# Altium project Circuit.PrjPcb
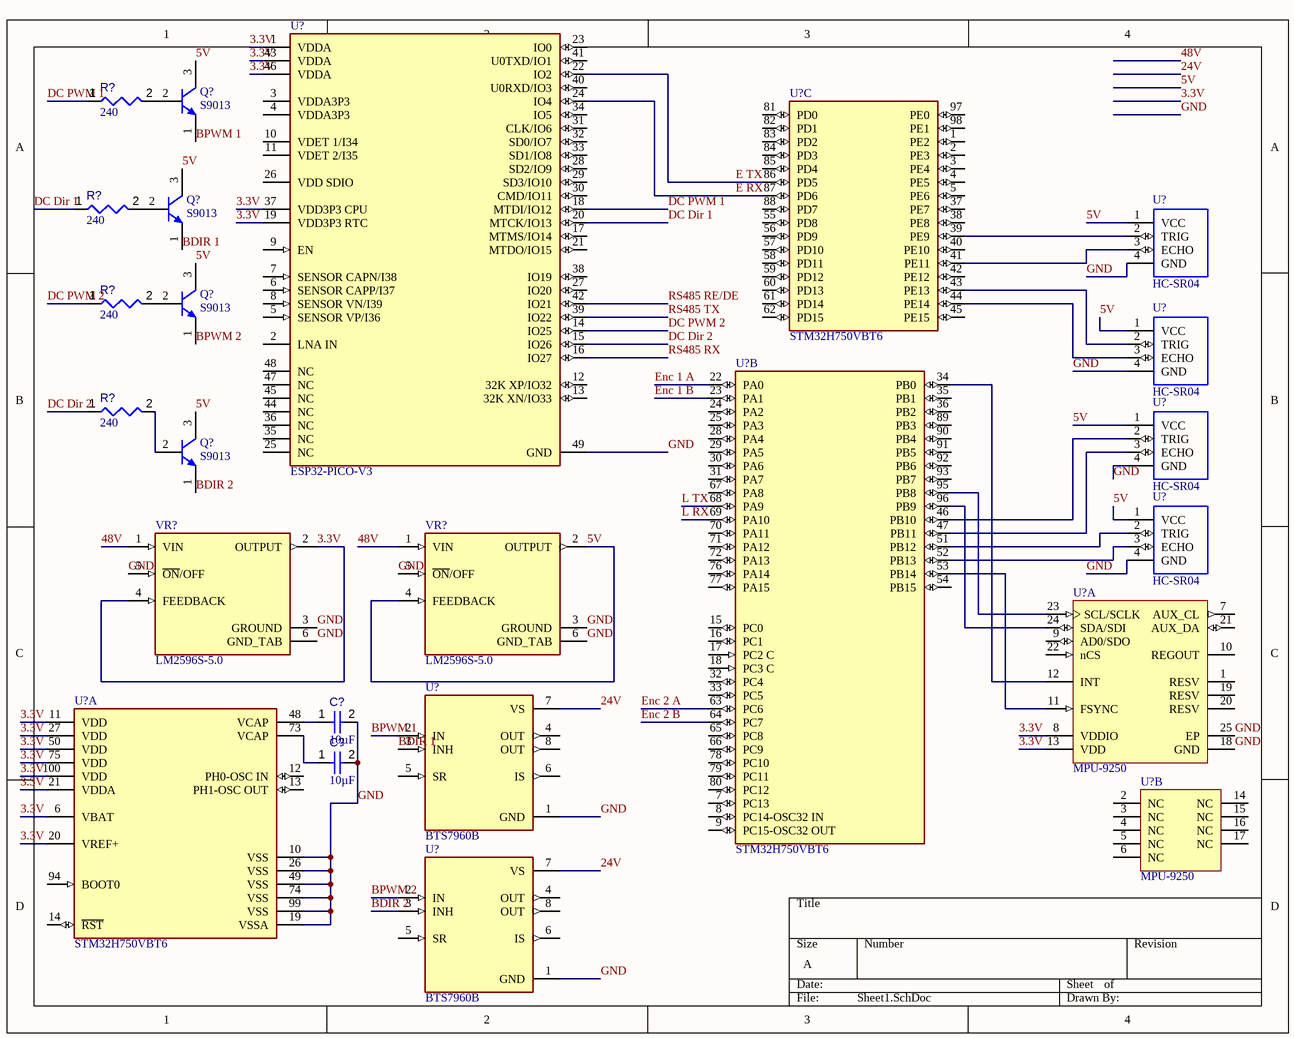
[diagram p0: Sheet1.SchDoc]
Author: Hassan; Project: Wheeled-Bi-Pedal-Robot; Schematic Name: Circuit Schematic
1 sheet, 24 parts. Net scope: global (net labels, ports and power ports of the same name join across sheets).
Board file: PCB1.PcbDoc

## Sheet Sheet1.SchDoc
size A; SheetNumber: 1; SheetTotal: 1

### Parts
(Parts that share a designator on the sheet are numbered #1, #2 ... from top to bottom, then left to right.)
C?#1  value 10µF  [CAPC0805(2012)145_L]  (hidden comment: Capacitor 10µF +/-20% 25V 0805)
C?#2  value 10µF  [CAPC0805(2012)145_L]  (hidden comment: Capacitor 10µF +/-20% 25V 0805)
Q?#1  S9013  [JSCJ-TO-92-3_V]
Q?#2  S9013  [JSCJ-TO-92-3_V]
Q?#3  S9013  [JSCJ-TO-92-3_V]
Q?#4  S9013  [JSCJ-TO-92-3_V]
R?#1  value 240  [RESC0402(1005)_L]  (hidden comment: 240R2J)
R?#2  value 240  [RESC0402(1005)_L]  (hidden comment: 240R2J)
R?#3  value 240  [RESC0402(1005)_L]  (hidden comment: 240R2J)
R?#4  value 240  [RESC0402(1005)_L]  (hidden comment: 240R2J)
U?#1  ESP32-PICO-V3  [FP-ESP32-PICO-V3-MFG]
U?#2  STM32H750VBT6  [FP-LQFP100-1L-MFG]  (part C of 3)
U?#3  HC-SR04  [XCVR_HC-SR04]
U?#4  HC-SR04  [XCVR_HC-SR04]
U?#5  STM32H750VBT6  [FP-LQFP100-1L-MFG]  (part B of 3)
U?#6  HC-SR04  [XCVR_HC-SR04]
U?#7  HC-SR04  [XCVR_HC-SR04]
U?#8  MPU-9250  [INSE-QFN-24-1700X1540TP_M]  (part A of 2)
U?#9  STM32H750VBT6  [FP-LQFP100-1L-MFG]  (part A of 3)
U?#10  BTS7960B  [DPAK127P1490X440-8N]
U?#11  MPU-9250  [INSE-QFN-24-1700X1540TP_M]  (part B of 2)
U?#12  BTS7960B  [DPAK127P1490X440-8N]
VR?#1  LM2596S-5.0  [TO170P1524X483-6N]
VR?#2  LM2596S-5.0  [TO170P1524X483-6N]

### Nets
3.3V: U?#1.1(VDDA) U?#1.19(VDD3P3_RTC) U?#1.37(VDD3P3_CPU) U?#1.43(VDDA) U?#1.46(VDDA) U?#8.8(VDDIO) U?#8.13(VDD) U?#9.6(VBAT) U?#9.11(VDD) U?#9.20(VREF+) U?#9.21(VDDA) U?#9.27(VDD) U?#9.50(VDD) U?#9.75(VDD) U?#9.100(VDD) VR?#1.2(OUTPUT) VR?#1.4(FEEDBACK)
5V: Q?#1.3(C) Q?#2.3(C) Q?#3.3(C) Q?#4.3(C) U?#3.1(VCC) U?#4.1(VCC) U?#6.1(VCC) U?#7.1(VCC) VR?#2.2(OUTPUT) VR?#2.4(FEEDBACK)
24V: U?#10.7(VS) U?#12.7(VS)
48V: VR?#1.1(VIN) VR?#2.1(VIN)
BDIR 1: Q?#2.1(E) U?#10.3(INH)
BDIR 2: Q?#4.1(E) U?#12.3(INH)
BPWM 1: Q?#1.1(E) U?#10.2(IN)
BPWM 2: Q?#3.1(E) U?#12.2(IN)
DC Dir 1: R?#2.1 U?#1.20(MTCK/IO13)
DC Dir 2: R?#4.1 U?#1.15(IO26)
DC PWM 1: R?#1.1 U?#1.18(MTDI/IO12)
DC PWM 2: R?#3.1 U?#1.14(IO25)
E RX: U?#1.24(IO4) U?#2.87(PD6)
E TX: U?#1.22(IO2) U?#2.86(PD5)
Enc 1 A: U?#5.22(PA0)
Enc 1 B: U?#5.23(PA1)
Enc 2 A: U?#5.63(PC6)
Enc 2 B: U?#5.64(PC7)
GND: C?#1.2 C?#2.2 U?#1.49(GND) U?#3.4(GND) U?#4.4(GND) U?#6.4(GND) U?#7.4(GND) U?#8.18(GND) U?#8.25(EP) U?#9.10(VSS) U?#9.19(VSSA) U?#9.26(VSS) U?#9.49(VSS) U?#9.74(VSS) U?#9.99(VSS) U?#10.1(GND) U?#12.1(GND) VR?#1.3(GROUND) VR?#1.5(~{ON}/OFF) VR?#1.6(GND_TAB) VR?#2.3(GROUND) VR?#2.5(~{ON}/OFF) VR?#2.6(GND_TAB)
L RX: U?#5.69(PA10)
L TX: U?#5.68(PA9)
RS485 RE/DE: U?#1.42(IO21)
RS485 RX: U?#1.16(IO27)
RS485 TX: U?#1.39(IO22)
NetC?#1_1: C?#1.1 U?#9.48(VCAP)
NetC?#2_1: C?#2.1 U?#9.73(VCAP)
NetQ?#1_2: Q?#1.2(B) R?#1.2
NetQ?#2_2: Q?#2.2(B) R?#2.2
NetQ?#3_2: Q?#3.2(B) R?#3.2
NetQ?#4_2: Q?#4.2(B) R?#4.2
NetU?#2_39: U?#2.39(PE9) U?#3.2(TRIG)
NetU?#2_41: U?#2.41(PE11) U?#3.3(ECHO)
NetU?#2_43: U?#2.43(PE13) U?#4.2(TRIG)
NetU?#2_44: U?#2.44(PE14) U?#4.3(ECHO)
NetU?#5_34: U?#5.34(PB0) U?#8.12(INT)
NetU?#5_46: U?#5.46(PB10) U?#6.2(TRIG)
NetU?#5_47: U?#5.47(PB11) U?#6.3(ECHO)
NetU?#5_51: U?#5.51(PB12) U?#7.2(TRIG)
NetU?#5_52: U?#5.52(PB13) U?#7.3(ECHO)
NetU?#5_53: U?#5.53(PB14) U?#8.11(FSYNC)
NetU?#5_95: U?#5.95(PB8) U?#8.23(SCL/SCLK)
NetU?#5_96: U?#5.96(PB9) U?#8.24(SDA/SDI)

Not connected (* = marked no-connect by the designer): U?#1 2(LNA_IN) 3(VDDA3P3) 4(VDDA3P3) 5(SENSOR_VP/I36) 6(SENSOR_CAPP/I37) 7(SENSOR_CAPN/I38) 8(SENSOR_VN/I39) 9(EN) 10(VDET_1/I34) 11(VDET_2/I35) 12(32K_XP/IO32) 13(32K_XN/IO33) 17(MTMS/IO14) 21(MTDO/IO15) 23(IO0) 25(NC) 26(VDD_SDIO) 27(IO20) 28(SD2/IO9) 29(SD3/IO10) 30(CMD/IO11) 31(CLK/IO6) 32(SD0/IO7) 33(SD1/IO8) 34(IO5) 35(NC) 36(NC) 38(IO19) 40(U0RXD/IO3) 41(U0TXD/IO1) 44(NC) 45(NC) 47(NC) 48(NC); U?#2 1(PE2) 2(PE3) 3(PE4) 4(PE5) 5(PE6) 37(PE7) 38(PE8) 40(PE10) 42(PE12) 45(PE15) 55(PD8) 56(PD9) 57(PD10) 58(PD11) 59(PD12) 60(PD13) 61(PD14) 62(PD15) 81(PD0) 82(PD1) 83(PD2) 84(PD3) 85(PD4) 88(PD7) 97(PE0) 98(PE1); U?#5 7(PC13) 8(PC14-OSC32_IN) 9(PC15-OSC32_OUT) 15(PC0) 16(PC1) 17(PC2_C) 18(PC3_C) 24(PA2) 25(PA3) 28(PA4) 29(PA5) 30(PA6) 31(PA7) 32(PC4) 33(PC5) 35(PB1) 36(PB2) 54(PB15) 65(PC8) 66(PC9) 67(PA8) 70(PA11) 71(PA12) 72(PA13) 76(PA14) 77(PA15) 78(PC10) 79(PC11) 80(PC12) 89(PB3) 90(PB4) 91(PB5) 92(PB6) 93(PB7); U?#8 1(RESV) 7(AUX_CL) 9(AD0/SDO) 10(REGOUT) 19(RESV) 20(RESV) 21(AUX_DA) 22(nCS); U?#9 12(PH0-OSC_IN) 13(PH1-OSC_OUT) 14(~{RST}) 94(BOOT0); U?#10 4(OUT) 5(SR) 6(IS) 8(OUT); U?#11 2(NC) 3(NC) 4(NC) 5(NC) 6(NC) 14(NC) 15(NC) 16(NC) 17(NC); U?#12 4(OUT) 5(SR) 6(IS) 8(OUT)

### Library data of the parts
C?#1 C?#2 = CMP-001-00079-4: Chip Capacitor, 10µF +/-20%, 25V, 0805, Thickness 1.45 mm; Tolerance: 10%; Max Operating Temperature: 85°C; Case/Package: 0805; Voltage Rating: 25V; Min Operating Temperature: -55°C; Mounting Technology: SMT; Pins: 2
Q?#1-Q?#4 = CMP-013-00000-3: Transistor, NPN, 0.1 uA, 150 MHz, 3-Pin TO-92; Manufacturer: Jiangsu Changjiang Electronics Technology; Case/Package: TO-92-3; Datasheet URL: http://www.cj-elec.com/txUpfile/20121910315050632.pdf; Datasheet Version: Rev. B, 11/2011; Package Description: 3-Pin Through Hole Device, Height 4.7 mm, Pitch 2.3 mm; Mounting Technology: TH; RoHS Compliant: False; Package Reference: TO-92-3
R?#1-R?#4 = CMP-009-00084-2: 240R 0.063W 5% 0402 (1005 Metric)  SMD; Power: 63mW; Pins: 2; Case/Package: 0402; Mounting Technology: SMT; Tolerance: 5%
U?#1 = CMP-194065-000030-1: RX TXRX MOD WIFI SURFACE MOUNT
U?#2 U?#5 U?#9 = CMP-12105-000017-1: IC MCU 32BIT 128KB FLASH 100LQFP; Manufacturer: STMicroelectronics; Number Of Uart Channels: 9; Number Of I/Os: 82; Max Junction Temp: +125°C; Data Bus Width: 32bits; Ram Size: 1MBytes; Min Supply Voltage: 1.62V; Number Of Spi Channels: 6; Number Of Adc Channels: 36; Max Supply Voltage: 3.6V; Standoff Height: 0.05mm; Interface: I2C,SPI,UART,USART,CAN,USB,LIN,IrDA,Ethernet,I2S,Other; Number Of A/D Converters: 3; Number Of I2C Channels: 4; Memory Size: 128KBytes; Frequency: 480MHz; Number Of Timers/Counters: 20; Number Of Ethernet Channels: 1; Core Architecture: ARM Cortex-M7; Number Of Usb Channels: 2; Number Of Pwm Channels: 42; Ambient Temperature Range High: +85°C; Temperature: -40°C to +125°C; ComponentLink2URL: https://www.st.com/resource/en/datasheet/stm32h750vb.pdf; Device Class L2: Embedded Processors and Controllers; Temperature Range Low: -40°C; Octopart: https://octopart.com/stm32h750vbt6-stmicroelectronics-94048547; Category: IC; Manufacturer Part Number: STM32H750VBT6; Height: 1.6mm; Lead Free: Yes; Device Class L1: Integrated Circuits (ICs); Digikey Description: IC MCU 32BIT 128KB FLASH 100LQFP; RoHS: TRUE; Ambient Temperature Range Low: -40°C; Device Class L3: Microcontrollers; ComponentLink2Description: Datasheet; Mouser Description: MCU 32-Bit STM32H750VB ARM Cortex M7 RISC 128KB Flash 1.8V/2.5V/3.3V 100-Pin LQFP Tray; Number Of Cores: 1; Automotive: No; Memory Type: FLASH; Package: LQFP100-1L; Temperature Range High: +125°C
U?#3 U?#4 U?#6 U?#7 = CMP-005-000000-1: Ultrasonic Sensor Module; MP: HC-SR04; Source: HC-SR04.SchLib; Price: None; Value: *; Design Item ID: HC-SR04; Pin Count: 4; Availability: Unavailable; Component Type: Standard; Package: None
U?#8 U?#11 = CMP-2100-03657-1: 9-axis MotionTracking device, 2.4 to 3,6 V, -40 to 85 degC, 24-Pin QFN, RoHS, Tape and Reel; Manufacturer: InvenSense; Max Supply Voltage: 3.6V; Min Supply Voltage: 2.4V; Package Reference: QFN-24; Package Quantity: 1; Datasheet Version: Rev. 1.0, 01/2014; Case/Package: QFN; Package Description: 24-Pin Quad Flat No-lead Package, Body 3 x 3 mm, Pitch 0.4 mm; Datasheet URL: http://datasheet.octopart.com/MPU-9250-InvenSense-datasheet-21859386.pdf; RoHSCompliant: true; Max Operating Temperature: 85degC; Height: 1mm; Mount: SurfaceMount; Manufacturer URL: http://www.invensense.com/; Width: 3.1mm; Min Operating Temperature: -40degC; Length: 3.1mm
U?#10 U?#12 = CMP-009-000000-1: Half Bridge Driver DC Motors, General Purpose DMOS PG-TO263-7-1; MF: Infineon; Pin Count: 8; Component Type: Standard; MP: BTS7960B; Check_prices: https://www.snapeda.com/parts/BTS7960B/Infineon/view-part/?ref=eda; SnapEDA_Link: https://www.snapeda.com/parts/BTS7960B/Infineon/view-part/?ref=snap; Package: TO-263 Infineon; Value: *; Design Item ID: BTS7960B; Source: BTS7960B.SchLib
VR?#1 VR?#2 = CMP-007-000000-1: SIMPLE SWITCHERÂ® 4.5V to 40V, 3A Low Component Count Step-Down Regulator; MP: LM2596S-5.0/NOPB; MF: Texas Instruments; Check_prices: https://www.snapeda.com/parts/LM2596S-5.0/NOPB/Texas+Instruments/view-part/?ref=eda; Component Type: Standard; Package: TO-263-5 Texas Instruments; Design Item ID: LM2596S-5.0; Value: *; Pin Count: 6; SnapEDA_Link: https://www.snapeda.com/parts/LM2596S-5.0/NOPB/Texas+Instruments/view-part/?ref=snap; Source: LM2596S-5.0.SchLib